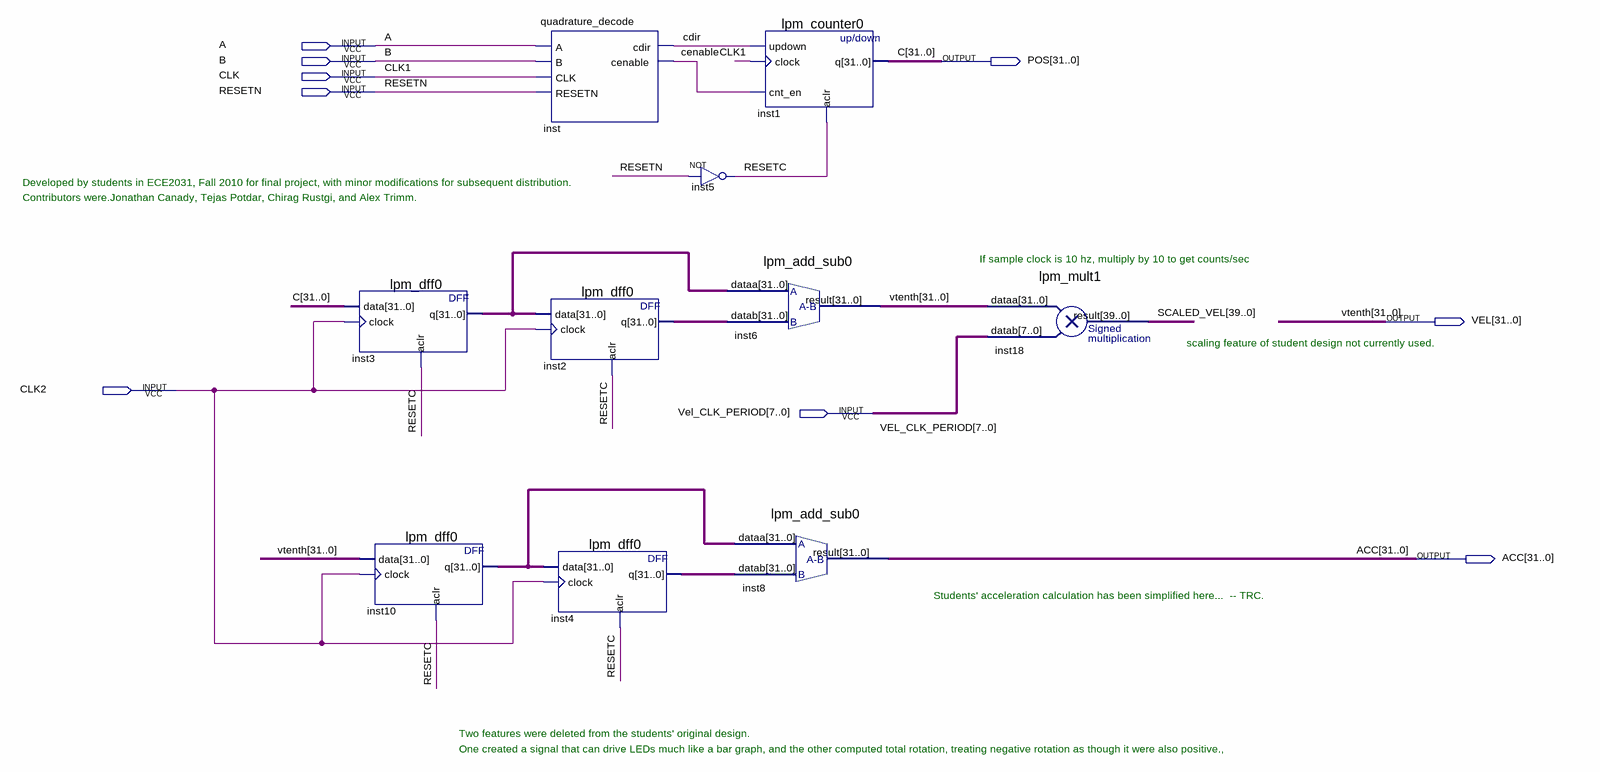
[diagram p0: schematic sheet]
// Quartus schematic posn_vel.bdf as structural Verilog: 10 symbols, 9 pins
module posn_vel (
  input  A,
  input  B,
  input  CLK,
  input  RESETN,
  input  CLK2,
  input  [7:0] Vel_CLK_PERIOD,
  output [31:0] POS,
  output [31:0] VEL,
  output [31:0] ACC
);

  wire cdir, cenable, RESETC;
  wire [31:0] inst2_q, inst3_q, inst4_q, inst10_q;
  wire [39:0] SCALED_VEL;

  lpm_dff0 inst3 (.data(POS), .clock(CLK2), .aclr(RESETC), .q(inst3_q));
  lpm_dff0 inst10 (.data(VEL), .clock(CLK2), .aclr(RESETC), .q(inst10_q));
  quadrature_decode inst (.A(A), .B(B), .CLK(CLK), .RESETN(RESETN), .cdir(cdir), .cenable(cenable));
  lpm_dff0 inst2 (.data(inst3_q), .clock(CLK2), .aclr(RESETC), .q(inst2_q));
  lpm_dff0 inst4 (.data(inst10_q), .clock(CLK2), .aclr(RESETC), .q(inst4_q));
  not inst5 (RESETC, RESETN);
  lpm_add_sub0 inst6 (.dataa(inst3_q), .datab(inst2_q), .result(VEL));
  lpm_add_sub0 inst8 (.dataa(inst10_q), .datab(inst4_q), .result(ACC));
  lpm_counter0 inst1 (.updown(cdir), .clock(CLK), .cnt_en(cenable), .aclr(RESETC), .q(POS));
  lpm_mult1 inst18 (.dataa(VEL), .datab(Vel_CLK_PERIOD), .result(SCALED_VEL));

  // Other names for the same wires on the sheet: C[31:0] = POS; CLK1 = CLK; vtenth[31:0] = VEL

  // Notes on the sheet:
  //   Developed by students in ECE2031, Fall 2010 for final project, with minor modifications for subsequent distribution.
  //   Contributors were.Jonathan Canady, Tejas Potdar, Chirag Rustgi, and Alex Trimm.
  //   If sample clock is 10 hz, multiply by 10 to get counts/sec
  //   scaling feature of student design not currently used.
  //   Students' acceleration calculation has been simplified here...  -- TRC.
  //   Two features were deleted from the students' original design.
  //   One created a signal that can drive LEDs much like a bar graph, and the other computed total rotation, treating negative rotation as though it were also positive.,
endmodule
